# EAGLE design pisniffer (EAGLE 9.3.2)
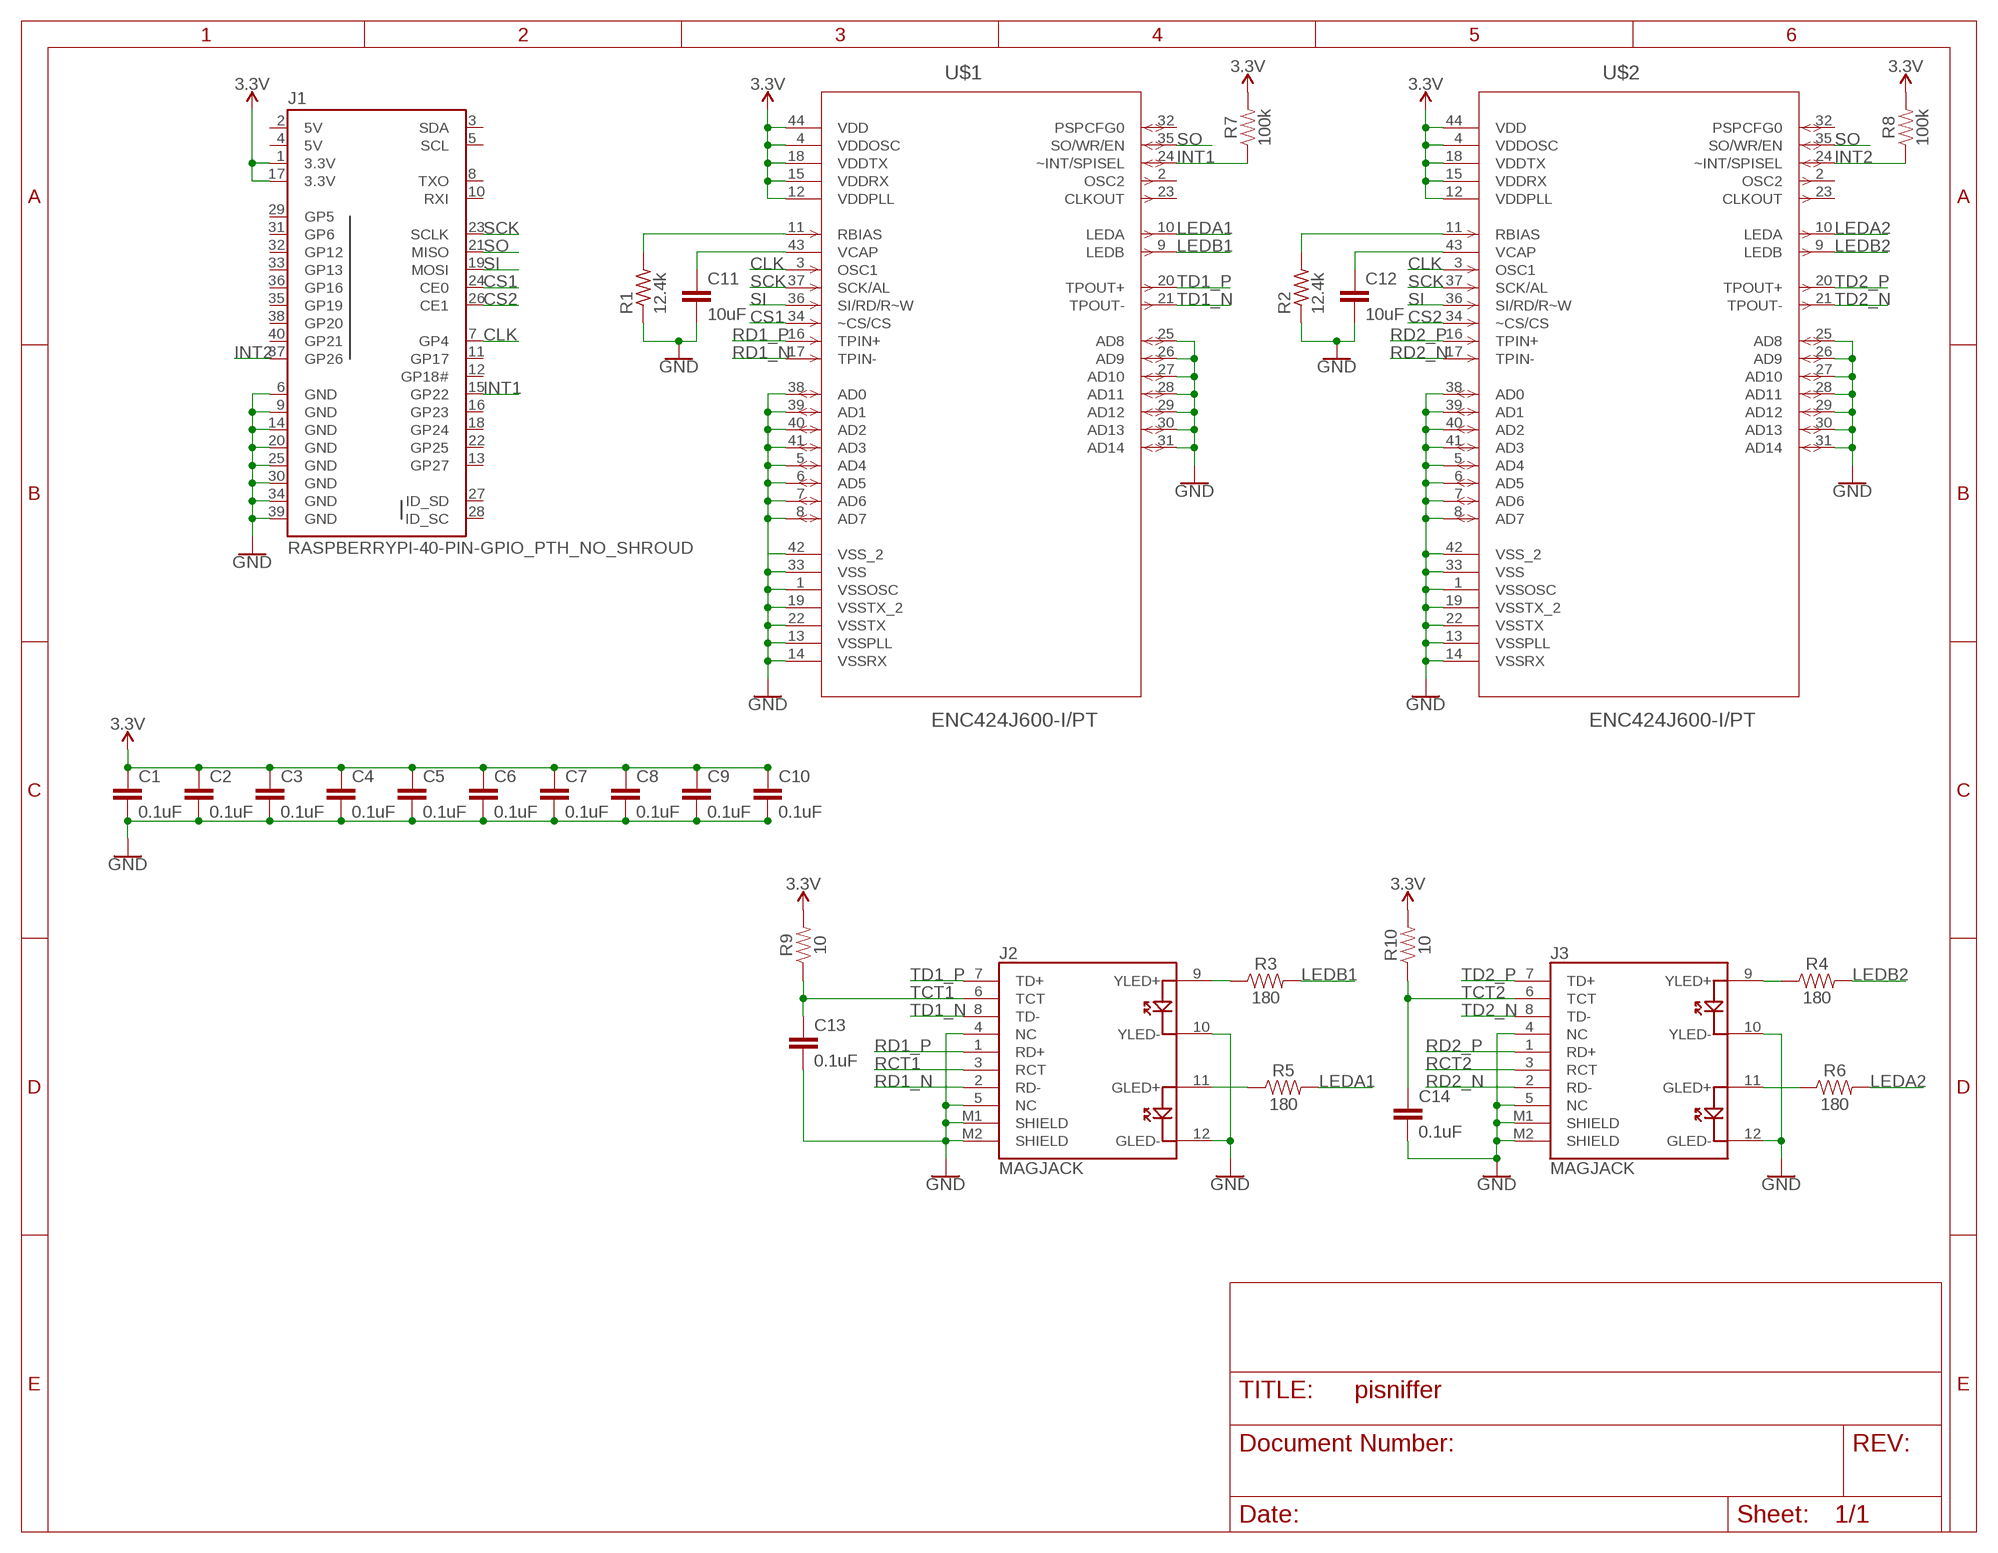
[diagram p0: schematic, sheet 1]

## Parts
C1  0.1uF  0.1UF-0603-25V-5%  [0603]
C2  0.1uF  0.1UF-0603-25V-5%  [0603]
C3  0.1uF  0.1UF-0603-25V-5%  [0603]
C4  0.1uF  0.1UF-0603-25V-5%  [0603]
C5  0.1uF  0.1UF-0603-25V-5%  [0603]
C6  0.1uF  0.1UF-0603-25V-5%  [0603]
C7  0.1uF  0.1UF-0603-25V-5%  [0603]
C8  0.1uF  0.1UF-0603-25V-5%  [0603]
C9  0.1uF  0.1UF-0603-25V-5%  [0603]
C10  0.1uF  0.1UF-0603-25V-5%  [0603]
C11  10uF  10UF-0603-6.3V-20%  [0603]
C12  10uF  10UF-0603-6.3V-20%  [0603]
C13  0.1uF  0.1UF-0603-25V-5%  [0603]
C14  0.1uF  0.1UF-0603-25V-5%  [0603]
J1  RASPBERRYPI-40-PIN-GPIO_PTH_NO_SHROUD  [2X20]
J2  MAGJACK  [MAGJACK]
J3  MAGJACK  [MAGJACK]
R1  12.4k  R-US_R0603  [R0603]
R2  12.4k  R-US_R0603  [R0603]
R3  180  180OHM-0603-1/10W-1%  [0603]
R4  180  180OHM-0603-1/10W-1%  [0603]
R5  180  180OHM-0603-1/10W-1%  [0603]
R6  180  180OHM-0603-1/10W-1%  [0603]
R7  100k  100KOHM-0603-1/10W-1%  [0603]
R8  100k  100KOHM-0603-1/10W-1%  [0603]
R9  10  10OHM-0603-1/10W-1%  [0603]
R10  10  10OHM-0603-1/10W-1%  [0603]
U$1  ENC424J600-I/PT  [QFP50P1200X1200X120-44N]
U$2  ENC424J600-I/PT  [QFP50P1200X1200X120-44N]

## Nets
3.3V: C1.1 C2.1 C3.1 C4.1 C5.1 C6.1 C7.1 C8.1 C9.1 C10.1 J1.1(3.3V) J1.17(3.3V) R7.2 R8.2 R9.2 R10.2 U$1.4(VDDOSC) U$1.12(VDDPLL) U$1.15(VDDRX) U$1.18(VDDTX) U$1.44(VDD) U$2.4(VDDOSC) U$2.12(VDDPLL) U$2.15(VDDRX) U$2.18(VDDTX) U$2.44(VDD)
CLK: J1.7(GP4) U$1.3(OSC1) U$2.3(OSC1)
CS1: J1.24(CE0) U$1.34(~CS/CS)
CS2: J1.26(CE1) U$2.34(~CS/CS)
GND: C1.2 C2.2 C3.2 C4.2 C5.2 C6.2 C7.2 C8.2 C9.2 C10.2 C11.2 C12.2 C13.2 C14.2 J1.6(GND) J1.9(GND) J1.14(GND) J1.20(GND) J1.25(GND) J1.30(GND) J1.34(GND) J1.39(GND) J2.4(NC) J2.5(NC) J2.10(YLED-) J2.12(GLED-) J2.M1(SHIELD) J2.M2(SHIELD) J3.4(NC) J3.5(NC) J3.10(YLED-) J3.12(GLED-) J3.M1(SHIELD) J3.M2(SHIELD) R1.1 R2.1 U$1.1(VSSOSC) U$1.5(AD4) U$1.6(AD5) U$1.7(AD6) U$1.8(AD7) U$1.13(VSSPLL) U$1.14(VSSRX) U$1.19(VSSTX_2) U$1.22(VSSTX) U$1.25(AD8) U$1.26(AD9) U$1.27(AD10) U$1.28(AD11) U$1.29(AD12) U$1.30(AD13) U$1.31(AD14) U$1.33(VSS) U$1.38(AD0) U$1.39(AD1) U$1.40(AD2) U$1.41(AD3) U$1.42(VSS_2) U$2.1(VSSOSC) U$2.5(AD4) U$2.6(AD5) U$2.7(AD6) U$2.8(AD7) U$2.13(VSSPLL) U$2.14(VSSRX) U$2.19(VSSTX_2) U$2.22(VSSTX) U$2.25(AD8) U$2.26(AD9) U$2.27(AD10) U$2.28(AD11) U$2.29(AD12) U$2.30(AD13) U$2.31(AD14) U$2.33(VSS) U$2.38(AD0) U$2.39(AD1) U$2.40(AD2) U$2.41(AD3) U$2.42(VSS_2)
INT1: J1.15(GP22) R7.1 U$1.24(~INT/SPISEL)
INT2: J1.37(GP26) R8.1 U$2.24(~INT/SPISEL)
LEDA1: R5.2 U$1.10(LEDA)
LEDA2: R6.2 U$2.10(LEDA)
LEDB1: R3.2 U$1.9(LEDB)
LEDB2: R4.2 U$2.9(LEDB)
N$1: C11.1 U$1.43(VCAP)
N$2: C12.1 U$2.43(VCAP)
N$3: R2.2 U$2.11(RBIAS)
N$4: R1.2 U$1.11(RBIAS)
N$5: J2.9(YLED+) R3.1
N$6: J2.11(GLED+) R5.1
N$8: J3.9(YLED+) R4.1
N$9: J3.11(GLED+) R6.1
RCT1: J2.3(RCT)
RCT2: J3.3(RCT)
RD1_N [ethernet]: J2.2(RD-) U$1.17(TPIN-)
RD1_P [ethernet]: J2.1(RD+) U$1.16(TPIN+)
RD2_N [ethernet]: J3.2(RD-) U$2.17(TPIN-)
RD2_P [ethernet]: J3.1(RD+) U$2.16(TPIN+)
SCK: J1.23(SCLK) U$1.37(SCK/AL) U$2.37(SCK/AL)
SI: J1.19(MOSI) U$1.36(SI/RD/R~W) U$2.36(SI/RD/R~W)
SO: J1.21(MISO) U$1.35(SO/WR/EN) U$2.35(SO/WR/EN)
TCT1: C13.1 J2.6(TCT) R9.1
TCT2: C14.1 J3.6(TCT) R10.1
TD1_N [ethernet]: J2.8(TD-) U$1.21(TPOUT-)
TD1_P [ethernet]: J2.7(TD+) U$1.20(TPOUT+)
TD2_N [ethernet]: J3.8(TD-) U$2.21(TPOUT-)
TD2_P [ethernet]: J3.7(TD+) U$2.20(TPOUT+)
Unconnected: J1.3(SDA) J1.5(SCL) J1.8(TXO) J1.10(RXI) J1.11(GP17) J1.12(GP18#) J1.13(GP27) J1.16(GP23) J1.18(GP24) J1.22(GP25) J1.27(ID_SD) J1.28(ID_SC) J1.29(GP5) J1.31(GP6) J1.32(GP12) J1.33(GP13) J1.35(GP19) J1.36(GP16) J1.38(GP20) J1.40(GP21) U$1.2(OSC2) U$1.23(CLKOUT) U$1.32(PSPCFG0) U$2.2(OSC2) U$2.23(CLKOUT) U$2.32(PSPCFG0)

## Power pins joined to a net without a drawn wire
5V: J1.2(5V) J1.4(5V)

## Library data of the parts
C1-C10 C13 C14 = SparkFun-Capacitors:0.1UF: 0.1µF ceramic capacitors A capacitor is a passive two-terminal electrical component used to store electrical energy temporarily in an electric field.; PROD_ID: CAP-08604
C11 C12 = SparkFun-Capacitors:10UF: 10.0µF ceramic capacitors A capacitor is a passive two-terminal electrical component used to store electrical energy temporarily in an electric field.; PROD_ID: CAP-11015
J1 = SparkFun-Connectors:RASPBERRYPI-40-PIN-GPIO: Raspberry Pi GPIO Header 2x20 pin connector, as found on B, B+, A+ models. Both shrouded PTH and SMT versions available. SparkFun Products: GPIO Shrouded Header <https://www.sparkfun.com/products/13054>- PTH SparkFun Pi Wedge (Preassembled) <https://www.sparkfun.com/products/13717>
J2 J3 = SparkFun-Connectors:MAGJACK: MAGJACK: RJ-45 with LEDs This is a single port, RJ45 ethernet jacks with built in transformer (magnetics), status LEDs, and shielding. Here is the connector we sell at SparkFun: RJ45 Ethernet MagJack-Compatible <https://www.sparkfun.com/products/8534> (PRT-08534) Datasheet <http://www.sparkfun.com/datasheets/Prototyping/MagJack.pdf> It is used on this SparkFun product: SparkFun RJ45 MagJack Breakout <https://www.sparkfun.com/products/13021> (BOB-13021); PROD_ID: CONN-09556; SF_ID: PRT-08534
R1 R2 = rcl:R-US_: RESISTOR, American symbol; SPICEPREFIX: R
R3-R6 = SparkFun-Resistors:180OHM: 180Ω resistor A resistor is a passive two-terminal electrical component that implements electrical resistance as a circuit element. Resistors act to reduce current flow, and, at the same time, act to lower voltage levels within circuits. - Wikipedia; PROD_ID: RES-08788
R7 R8 = SparkFun-Resistors:100KOHM: 100kΩ resistor A resistor is a passive two-terminal electrical component that implements electrical resistance as a circuit element. Resistors act to reduce current flow, and, at the same time, act to lower voltage levels within circuits. - Wikipedia; PROD_ID: RES-07828
R9 R10 = SparkFun-Resistors:10OHM: 10Ω resistor A resistor is a passive two-terminal electrical component that implements electrical resistance as a circuit element. Resistors act to reduce current flow, and, at the same time, act to lower voltage levels within circuits. - Wikipedia; PROD_ID: RES-12581
U$1 U$2 = ENC424J600:ENC424J600-I/PT: Stand-Alone 10/100 Ethernet Controller; DESCRIPTION: Stand-Alone 10/100 Ethernet Controller; MPN: enc424j600-I/pt; OC_FARNELL: 1740226; OC_NEWARK: 07P9120; PACKAGE: TQFP-44; SUPPLIER: Microchip

## Net classes
0 default: width 0.152 mm
1 ethernet: width 0.305 mm

## Board
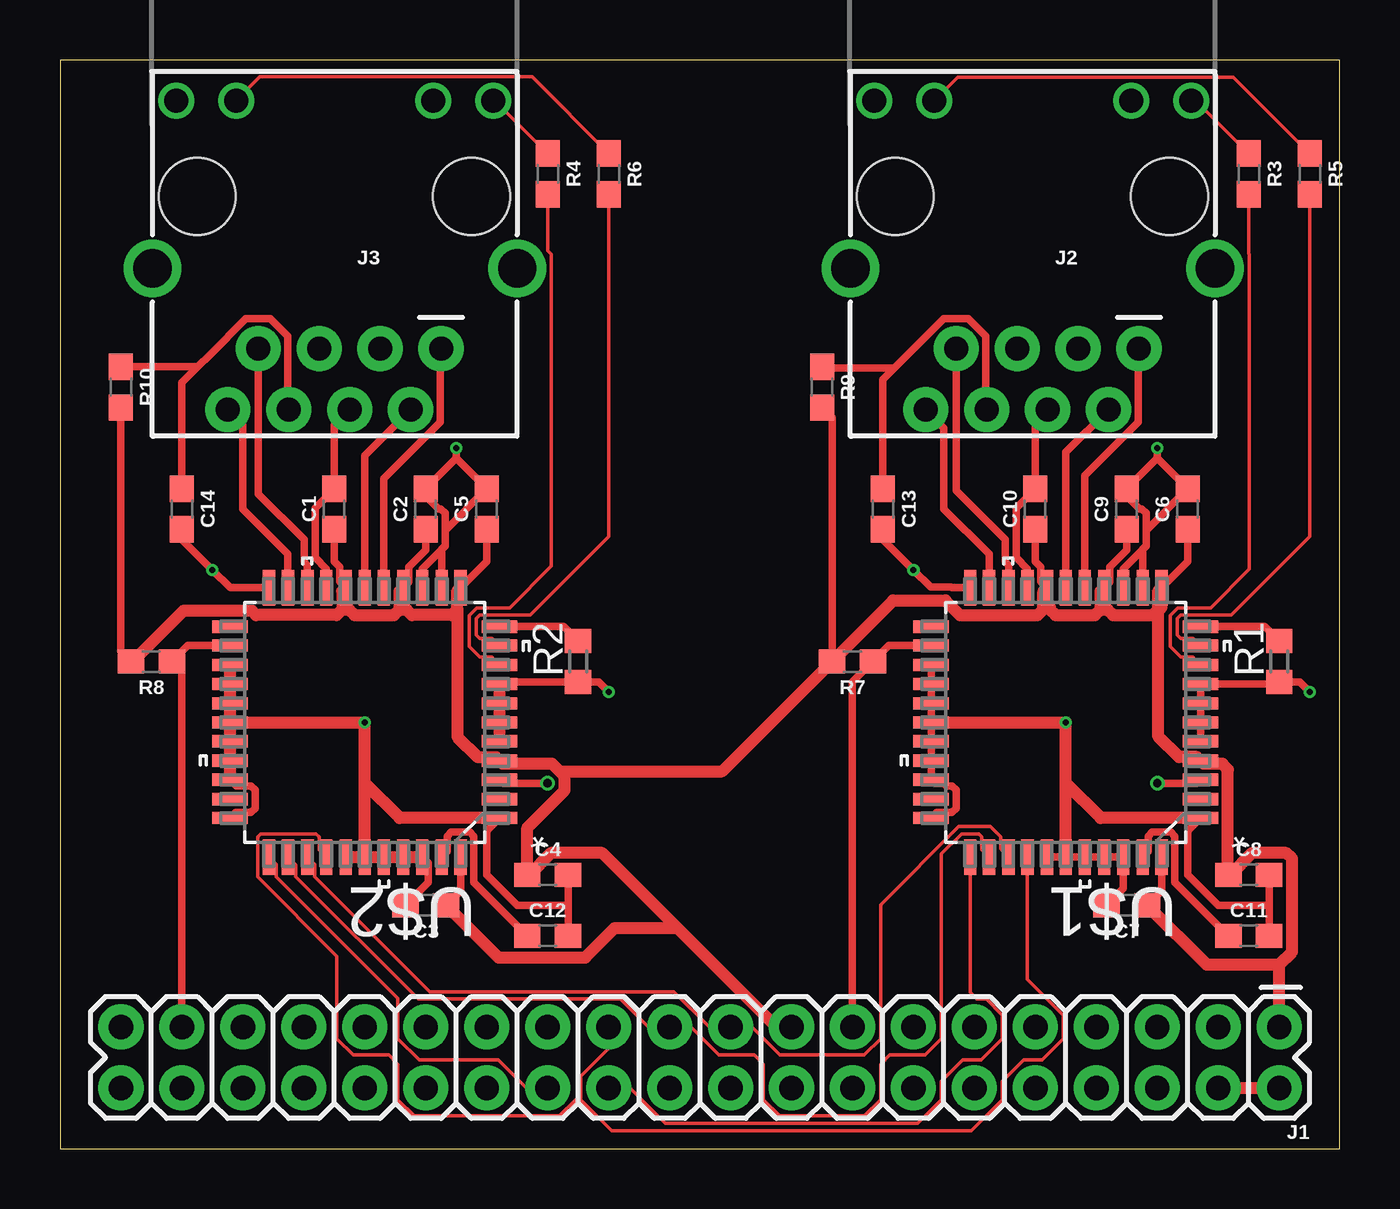
[diagram p1: board, top side]
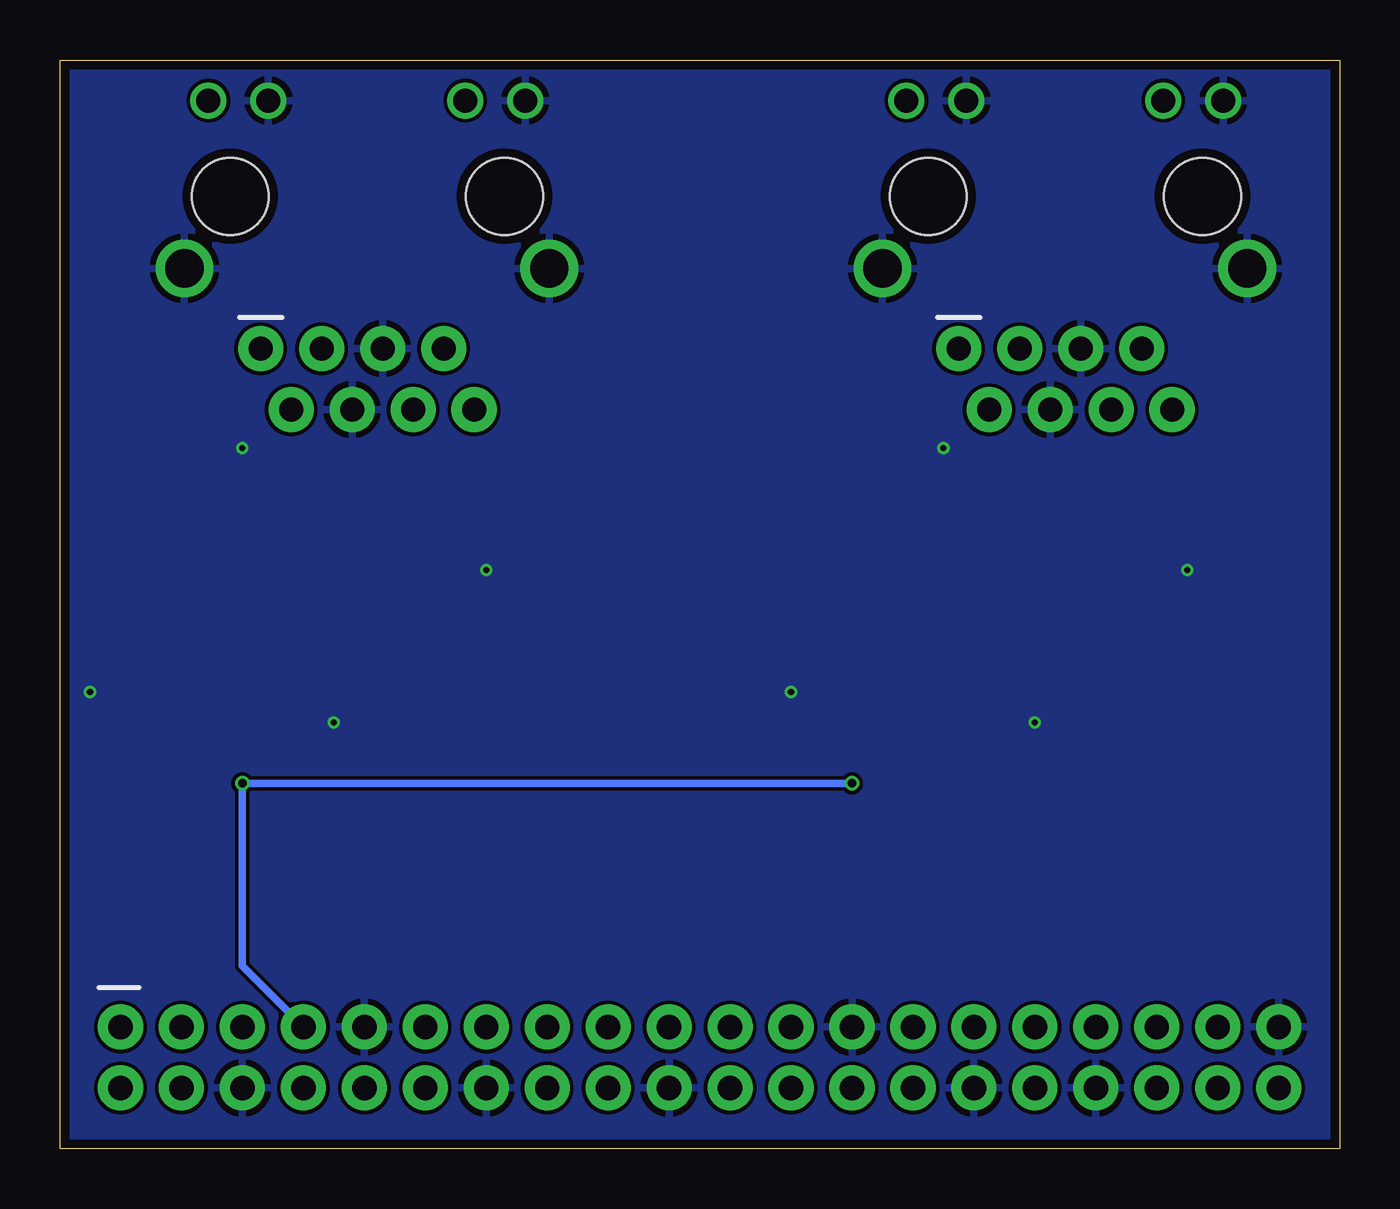
[diagram p2: board, bottom side, seen from below]

Size 53.32 x 45.39 mm. Coordinates in mm from the lower left corner, seen from the top.
Outline: 0,0 53.32,0 53.32,45.39 0,45.39 0,0
Copper layers (1*16): Top 0.035559375mm / dielectric 1.6mm / Bottom 0.035559375mm
Design rules "oshpark-2layer": minimum track width 6mil, minimum drill 10mil, track to track 6mil, track to pad 6mil, pad to pad 6mil, via to via 6mil, smd to smd 6mil, copper to edge 15mil, drill to drill 6mil, minimum pad ring 5mil, minimum via ring 5mil, stop-mask expansion 2.5mil, vias tented up to drill 0mil, thermal gap 10mil

### Footprints (pad centres in the part's own frame; a part is rotated, then mirrored left to right if it is on the bottom)
0603 = smd 1.1 x 1: 1 -0.85,0; 2 0.85,0
2X20 = drill 1.016 pad 1.88: 1 0,0; 2 0,2.54; 3 2.54,0; 4 2.54,2.54; 5 5.08,0; 6 5.08,2.54; 7 7.62,0; 8 7.62,2.54; 9 10.16,0; 10 10.16,2.54; 11 12.7,0; 12 12.7,2.54; 13 15.24,0; 14 15.24,2.54; 15 17.78,0; 16 17.78,2.54; 17 20.32,0; 18 20.32,2.54; 19 22.86,0; 20 22.86,2.54; 21 25.4,0; 22 25.4,2.54; 23 27.94,0; 24 27.94,2.54; 25 30.48,0; 26 30.48,2.54; 27 33.02,0; 28 33.02,2.54; 29 35.56,0; 30 35.56,2.54; 31 38.1,0; 32 38.1,2.54; 33 40.64,0; 34 40.64,2.54; 35 43.18,0; 36 43.18,2.54; 37 45.72,0; 38 45.72,2.54; 39 48.26,0; 40 48.26,2.54
MAGJACK = drill 1 pad 1.88: 1 3.175,17.445; 2 4.445,19.985; 3 5.715,17.445; 4 6.985,19.985; 5 8.255,17.445; 6 9.525,19.985; 7 10.795,17.445; 8 12.065,19.985 | drill 1 pad 1.27: 9 1,7.1; 10 3.5,7.1; 11 11.7,7.1; 12 14.2,7.1 | drill 1.6 pad 2.184: M1 0,14.1; M2 15.2,14.1 | hole 3.2: 1.905,11.095; 13.335,11.095
R0603 = smd 1 x 1.1: 1 -0.85,0; 2 0.85,0
QFP50P1200X1200X120-44N = smd 1.473 x 0.508: 1 -5.613,3.988; 2 -5.613,3.2; 3 -5.613,2.388; 4 -5.613,1.6; 5 -5.613,0.787; 6 -5.613,0; 7 -5.613,-0.787; 8 -5.613,-1.6; 9 -5.613,-2.388; 10 -5.613,-3.2; 11 -5.613,-3.988; 23 5.613,-3.988; 24 5.613,-3.2; 25 5.613,-2.388; 26 5.613,-1.6; 27 5.613,-0.787; 28 5.613,0; 29 5.613,0.787; 30 5.613,1.6; 31 5.613,2.388; 32 5.613,3.2; 33 5.613,3.988 | smd 0.508 x 1.473: 12 -3.988,-5.613; 13 -3.2,-5.613; 14 -2.388,-5.613; 15 -1.6,-5.613; 16 -0.787,-5.613; 17 0,-5.613; 18 0.787,-5.613; 19 1.6,-5.613; 20 2.388,-5.613; 21 3.2,-5.613; 22 3.988,-5.613; 34 3.988,5.613; 35 3.2,5.613; 36 2.388,5.613; 37 1.6,5.613; 38 0.787,5.613; 39 0,5.613; 40 -0.787,5.613; 41 -1.6,5.613; 42 -2.388,5.613; 43 -3.2,5.613; 44 -3.988,5.613

### Placement (x,y rotation side)
C1  11.43,26.67 90 top
C2  15.24,26.67 90 top
C3  15.24,10.16 180 top
C4  20.32,11.43 0 top
C5  17.78,26.67 90 top
C6  46.99,26.67 90 top
C7  44.45,10.16 180 top
C8  49.53,11.43 0 top
C9  44.45,26.67 90 top
C10  40.64,26.67 90 top
C11  49.53,8.89 0 top
C12  20.32,8.89 0 top
C13  34.29,26.67 270 top
C14  5.08,26.67 270 top
J1  50.8,5.08 180 top
J2  48.13,50.8 180 top
J3  19.05,50.8 180 top
R1  50.8,20.32 90 top
R2  21.59,20.32 90 top
R3  49.53,40.64 270 top
R4  20.32,40.64 270 top
R5  52.07,40.64 270 top
R6  22.86,40.64 270 top
R7  33.02,20.32 180 top
R8  3.81,20.32 180 top
R9  31.75,31.75 270 top
R10  2.54,31.75 270 top
U$1  41.91,17.78 180 top
U$2  12.7,17.78 180 top

### Tracks (layer width: path | path; a pad name or v marks a point on that pad's centre or on a via)
3.3V
  Top 0.305: U$2.15 14.53,23.62 14.53,24.26 15.24,24.97 C2.1 | U$2.12 17.78,24.49 C5.1 | U$2.18 11.66,23.65 11.66,24.26 11.43,24.48 C1.1 | U$2.44 16.69,10.76 C3.1 | U$1.44 45.9,10.76 C7.1 | U$1.15 43.74,23.62 43.74,24.26 44.45,24.97 C9.1 | U$1.12 46.99,24.49 C6.1 | U$1.18 40.87,23.65 40.87,24.26 40.64,24.48 C10.1 | R8.2 2.54,20.74 R10.2 | R9.2 32.17,30.48 R7.2
  Top 0.508: U$2.18 11.76,23.24 11.76,22.49 | 11.76,22.49 11.52,22.25 8.17,22.25 7.99,22.43 5.14,22.43 3.04,20.32 R8.2 | 11.76,22.49 12.04,22.49 12.28,22.25 13.91,22.25 14.15,22.49 | 14.15,22.49 14.15,23.24 U$2.15 | 14.15,22.49 14.43,22.49 14.66,22.25 16.32,22.25 16.56,22.49 | 16.56,22.49 16.56,23.27 U$2.12 | J1.17 29.84,5.08 25.72,9.21 | 25.72,9.21 22.59,12.34 20.45,12.34 19.55,11.43 C4.1 19.47,13.39 21.03,14.95 21.03,15.53 20.82,15.74 | 25.72,9.21 23.11,9.21 21.89,7.98 18.27,7.98 C3.1 | 16.56,22.49 16.56,17.18 17.41,16.33 18.16,16.33 U$2.4 18.44,16.05 20.51,16.05 20.82,15.74 | J1.1 50.8,7.68 | 50.8,7.68 51.34,8.22 51.34,12.1 51.1,12.34 49.66,12.34 48.76,11.43 C8.1 48.67,11.44 48.67,15.81 48.43,16.05 47.65,16.05 U$1.4 47.37,16.33 46.62,16.33 45.77,17.18 45.77,22.44 45.9,22.57 U$1.12 45.77,23.27 45.77,22.49 45.53,22.25 43.88,22.25 43.64,22.49 43.36,22.49 | 40.97,22.86 40.97,22.49 40.73,22.25 37.5,22.25 36.89,22.86 34.71,22.86 R7.2 27.59,15.74 20.82,15.74 | 40.97,22.86 40.97,23.24 U$1.18 | 43.36,22.49 43.12,22.25 41.49,22.25 41.25,22.49 41.25,22.58 40.97,22.86 | 43.36,22.49 43.36,23.24 U$1.15 | C7.1 47.77,7.68 50.8,7.68
5V
  Top 0.508: J1.4 J1.2
CLK  (via drill 0.35)
  Top 0.305: U$2.3 18.47,15.24 v20.32,15.24 | v45.72,15.24 47.37,15.24 U$1.3
  Bottom 0.305: v20.32,15.24 v45.72,15.24 45.72,7.62 J1.7
CS1
  Top 0.152: U$1.34 37.92,6.53 38.2,6.25 38.58,6.25 39.27,5.56 39.27,4.6 38.38,3.71 37.62,3.71 36.73,2.82 36.73,2.06 35.74,1.07 25.22,1.07 23.75,2.54 J1.24
CS2
  Top 0.152: U$2.34 9.02,11.86 9.02,11.34 14.07,6.28 14.07,4.6 14.96,3.71 18.26,3.71 19.43,2.54 J1.26
GND  (via drill 0.25)
  Top 0.305: U$2.14 15.09,24.17 16.05,25.13 16.05,26.5 15.87,26.68 15.78,26.68 15.09,27.37 C2.2 16.51,28.79 | U$2.13 15.9,25 16.05,25.14 16.05,25.79 C5.2 16.51,28.79 | U$2.19 11.1,24.17 10.62,24.64 10.62,26.71 C1.2 11.43,30.18 J3.4 | U$2.42 15.34,11.91 15.34,11.11 C3.2 | C7.2 44.3,10.86 U$1.42 U$1.41 U$1.40 U$1.39 U$1.38 | U$1.14 44.3,24.17 45.26,25.13 45.26,26.5 45.08,26.68 44.99,26.68 44.3,27.37 C9.2 45.72,28.79 | U$1.13 45.11,25 45.26,25.14 45.26,25.79 C6.2 45.72,28.79 | U$1.19 40.31,24.17 39.84,24.64 39.84,26.71 C10.2 40.64,30.31 J2.4 | C12.2 21.17,10.16 | 21.17,10.16 C4.2 | C11.2 50.38,10.16 | 50.38,10.16 C8.2 | U$2.8 18.4,19.47 R2.1 22.44,19.47 v22.86,19.05 | U$2.31 7.34,15.14 7.95,15.14 8.13,14.96 8.13,14.2 7.95,14.02 7.32,14.02 U$2.33 | U$1.5 U$1.6 U$1.7 U$1.8 50.71,19.38 R1.1 51.65,19.47 v52.07,19.05 | U$1.25 U$1.26 U$1.27 U$1.28 U$1.29 U$1.30 U$1.31 36.45,15.24 36.83,15.24 36.93,15.14 37.16,15.14 37.34,14.96 37.34,14.2 37.16,14.02 36.52,14.02 U$1.33 | 21.17,10.16 19.05,10.16 17.78,11.43 17.78,13.26 U$2.1 | 50.38,10.16 48.26,10.16 46.99,11.43 46.99,13.26 U$1.1 | 16.51,28.79 v16.51,29.21 | U$2.22 7.09,23.39 v6.35,24.13 5.08,25.4 C14.2 | U$1.22 37.15,23.39 37.12,23.42 36.27,23.42 v35.56,24.13 34.29,25.4 C13.2 | 45.72,28.79 v45.72,29.21
  Top 0.508: U$2.38 U$2.39 | U$2.39 U$2.40 U$2.41 U$2.42 | U$2.31 U$2.30 U$2.29 U$2.28 | U$2.28 U$2.27 U$2.26 U$2.25 | U$2.5 U$2.6 U$2.7 U$2.8 | U$1.28 v41.91,17.78 41.91,15.24 | U$1.39 41.91,15.24 | U$1.1 43.36,13.79 41.91,15.24 | U$2.28 v12.7,17.78 12.7,15.24 | U$2.39 12.7,15.24 | U$2.1 14.15,13.79 12.7,15.24
  pour Bottom: 0,0 53.34,0 53.34,45.72 0,45.72
INT1
  Top 0.305: U$1.24 34.53,20.98 R7.1 33.02,19.47 J1.15
INT2
  Top 0.305: U$2.24 5.32,20.98 R8.1 5.08,19.9 J1.37
LEDA1
  Top 0.152: U$1.10 47.22,21.29 46.69,21.29 46.56,21.42 46.56,22.12 46.69,22.25 48.79,22.25 52.07,25.53 R5.2
LEDA2
  Top 0.152: R6.2 22.86,25.53 19.58,22.25 17.48,22.25 17.35,22.12 17.35,21.42 17.48,21.29 18.01,21.29 U$2.10
LEDB1
  Top 0.152: U$1.9 47.19,20.5 46.69,20.5 46.25,20.94 46.25,22.24 46.57,22.55 47.95,22.55 49.56,24.16 49.56,37.29 49.53,37.32 R3.2
LEDB2
  Top 0.152: U$2.9 17.98,20.5 17.48,20.5 17.04,20.94 17.04,22.24 17.36,22.55 18.75,22.55 20.48,24.29 20.48,37.29 20.32,37.45 R4.2
N$1
  Top 0.305: C11.1 46.46,11.11 46.46,13.03 46.28,13.21 45.52,13.21 45.34,13.03 45.34,12.39 U$1.43
N$2
  Top 0.305: C12.1 17.25,11.11 17.25,13.03 17.07,13.21 16.31,13.21 16.13,13.03 16.13,12.39 U$2.43
N$3
  Top 0.305: R2.2 20.99,21.77 U$2.11
N$4
  Top 0.305: R1.2 50.2,21.77 U$1.11
N$5
  Top 0.152: R3.1 47.32,43.7 J2.9
N$6
  Top 0.152: R5.1 48.88,44.68 37.41,44.68 J2.11
N$8
  Top 0.152: R4.1 18.11,43.7 J3.9
N$9
  Top 0.152: R6.1 19.67,44.68 8.33,44.68 J3.11
RD1_N
  Top 0.305: U$1.17 41.91,29.04 J2.2
RD1_P
  Top 0.305: J2.1 44.93,33.33 44.93,30.3 42.7,28.06 U$1.16
RD2_N
  Top 0.305: U$2.17 12.7,28.91 J3.2
RD2_P
  Top 0.305: J3.1 15.85,33.33 15.85,30.3 13.49,27.94 U$2.16
SCK
  Top 0.152: 21.69,2.06 21.69,3.02 22.86,4.19 J1.23 | U$1.37 40.31,7.06 41.81,5.56 41.81,4.6 40.92,3.71 40.16,3.71 39.27,2.82 39.27,2.06 37.97,0.76 22.99,0.76 21.69,2.06 | 21.69,2.06 21.49,2.06 20.8,1.37 14.76,1.37 14.07,2.06 14.07,3.53 13.69,3.91 12.22,3.91 11.53,4.6 11.53,8.03 8.23,11.34 8.23,13 8.36,13.13 10.66,13.13 10.79,13 10.79,12.47 U$2.37
SI
  Top 0.152: U$1.36 39.19,12.5 39.19,13 38.75,13.44 37.45,13.44 34.19,10.18 34.19,4.6 33.5,3.91 30,3.91 28.83,5.08 J1.19 27.05,5.08 25.58,6.55 15.4,6.55 10.62,11.34 10.62,11.86 U$2.36
SO
  Top 0.152: U$1.35 38.41,12.47 38.41,13 38.27,13.13 37.57,13.13 36.73,12.29 36.73,4.6 36.04,3.91 34.57,3.91 34.19,3.53 34.19,2.06 33.5,1.37 30,1.37 29.31,2.06 29.31,3.53 28.93,3.91 27.46,3.91 26.29,5.08 J1.21 24.51,5.08 23.34,6.25 14.92,6.25 9.83,11.34 9.83,11.84 U$2.35
TCT1
  Top 0.305: 34.77,32.54 36.82,34.6 37.85,34.6 38.58,33.87 38.58,30.84 J2.6 | 34.77,32.54 34.29,32.07 C13.1 | 34.77,32.54 31.81,32.54 R9.1
TCT2
  Top 0.305: 5.74,32.6 R10.1 | 5.74,32.6 6.25,33.12 7.74,34.6 8.77,34.6 9.5,33.87 9.5,30.84 J3.6 | 5.74,32.6 5.08,31.94 C14.1
TD1_N
  Top 0.305: U$1.21 38.71,24.79 36.83,26.67 36.83,30.05 J2.8
TD1_P
  Top 0.305: U$1.20 39.52,24.31 39.38,24.45 39.38,25.39 37.34,27.43 J2.7
TD2_N
  Top 0.305: U$2.21 9.5,24.79 7.62,26.67 7.62,30.18 J3.8
TD2_P
  Top 0.305: U$2.20 10.31,24.31 10.17,24.45 10.17,25.39 8.26,27.3 J3.7